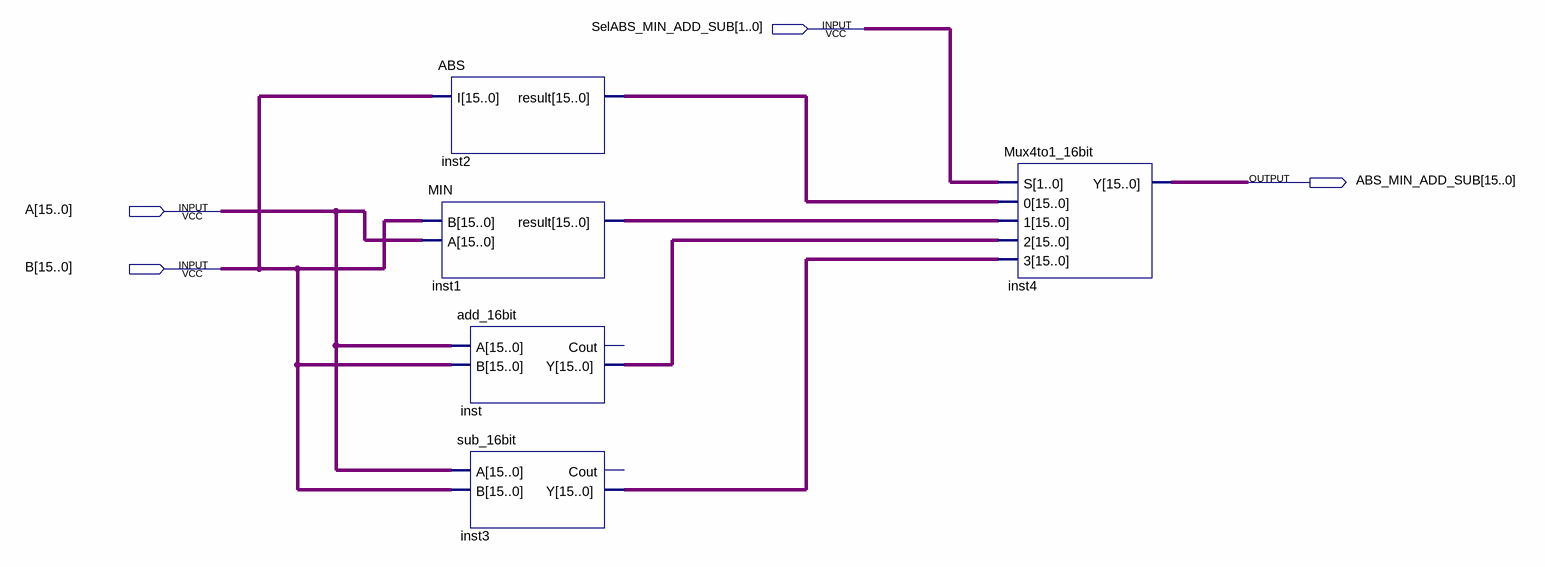
[diagram p0: schematic sheet]
// Quartus schematic ABS_MIN_ADD_SUB.bdf as structural Verilog: 5 symbols, 4 pins
module ABS_MIN_ADD_SUB (
  input  [1:0] SelABS_MIN_ADD_SUB,
  input  [15:0] A,
  input  [15:0] B,
  output [15:0] ABS_MIN_ADD_SUB
);

  wire [15:0] inst1_result, inst2_result, inst3_y, inst_y;

  ABS inst2 (.I(B), .result(inst2_result));
  MIN inst1 (.B(B), .A(A), .result(inst1_result));
  add_16bit inst (.A(A), .B(B), .Y(inst_y));  // open: Cout
  sub_16bit inst3 (.A(A), .B(B), .Y(inst3_y));  // open: Cout
  Mux4to1_16bit inst4 (
    .S(SelABS_MIN_ADD_SUB), .\0 (inst2_result), .\1 (inst1_result), .\2 (inst_y), .\3 (inst3_y),
    .Y(ABS_MIN_ADD_SUB));
endmodule
